# Altium schematic sheet PV_PWM_heater_v2.SchDoc
size A3
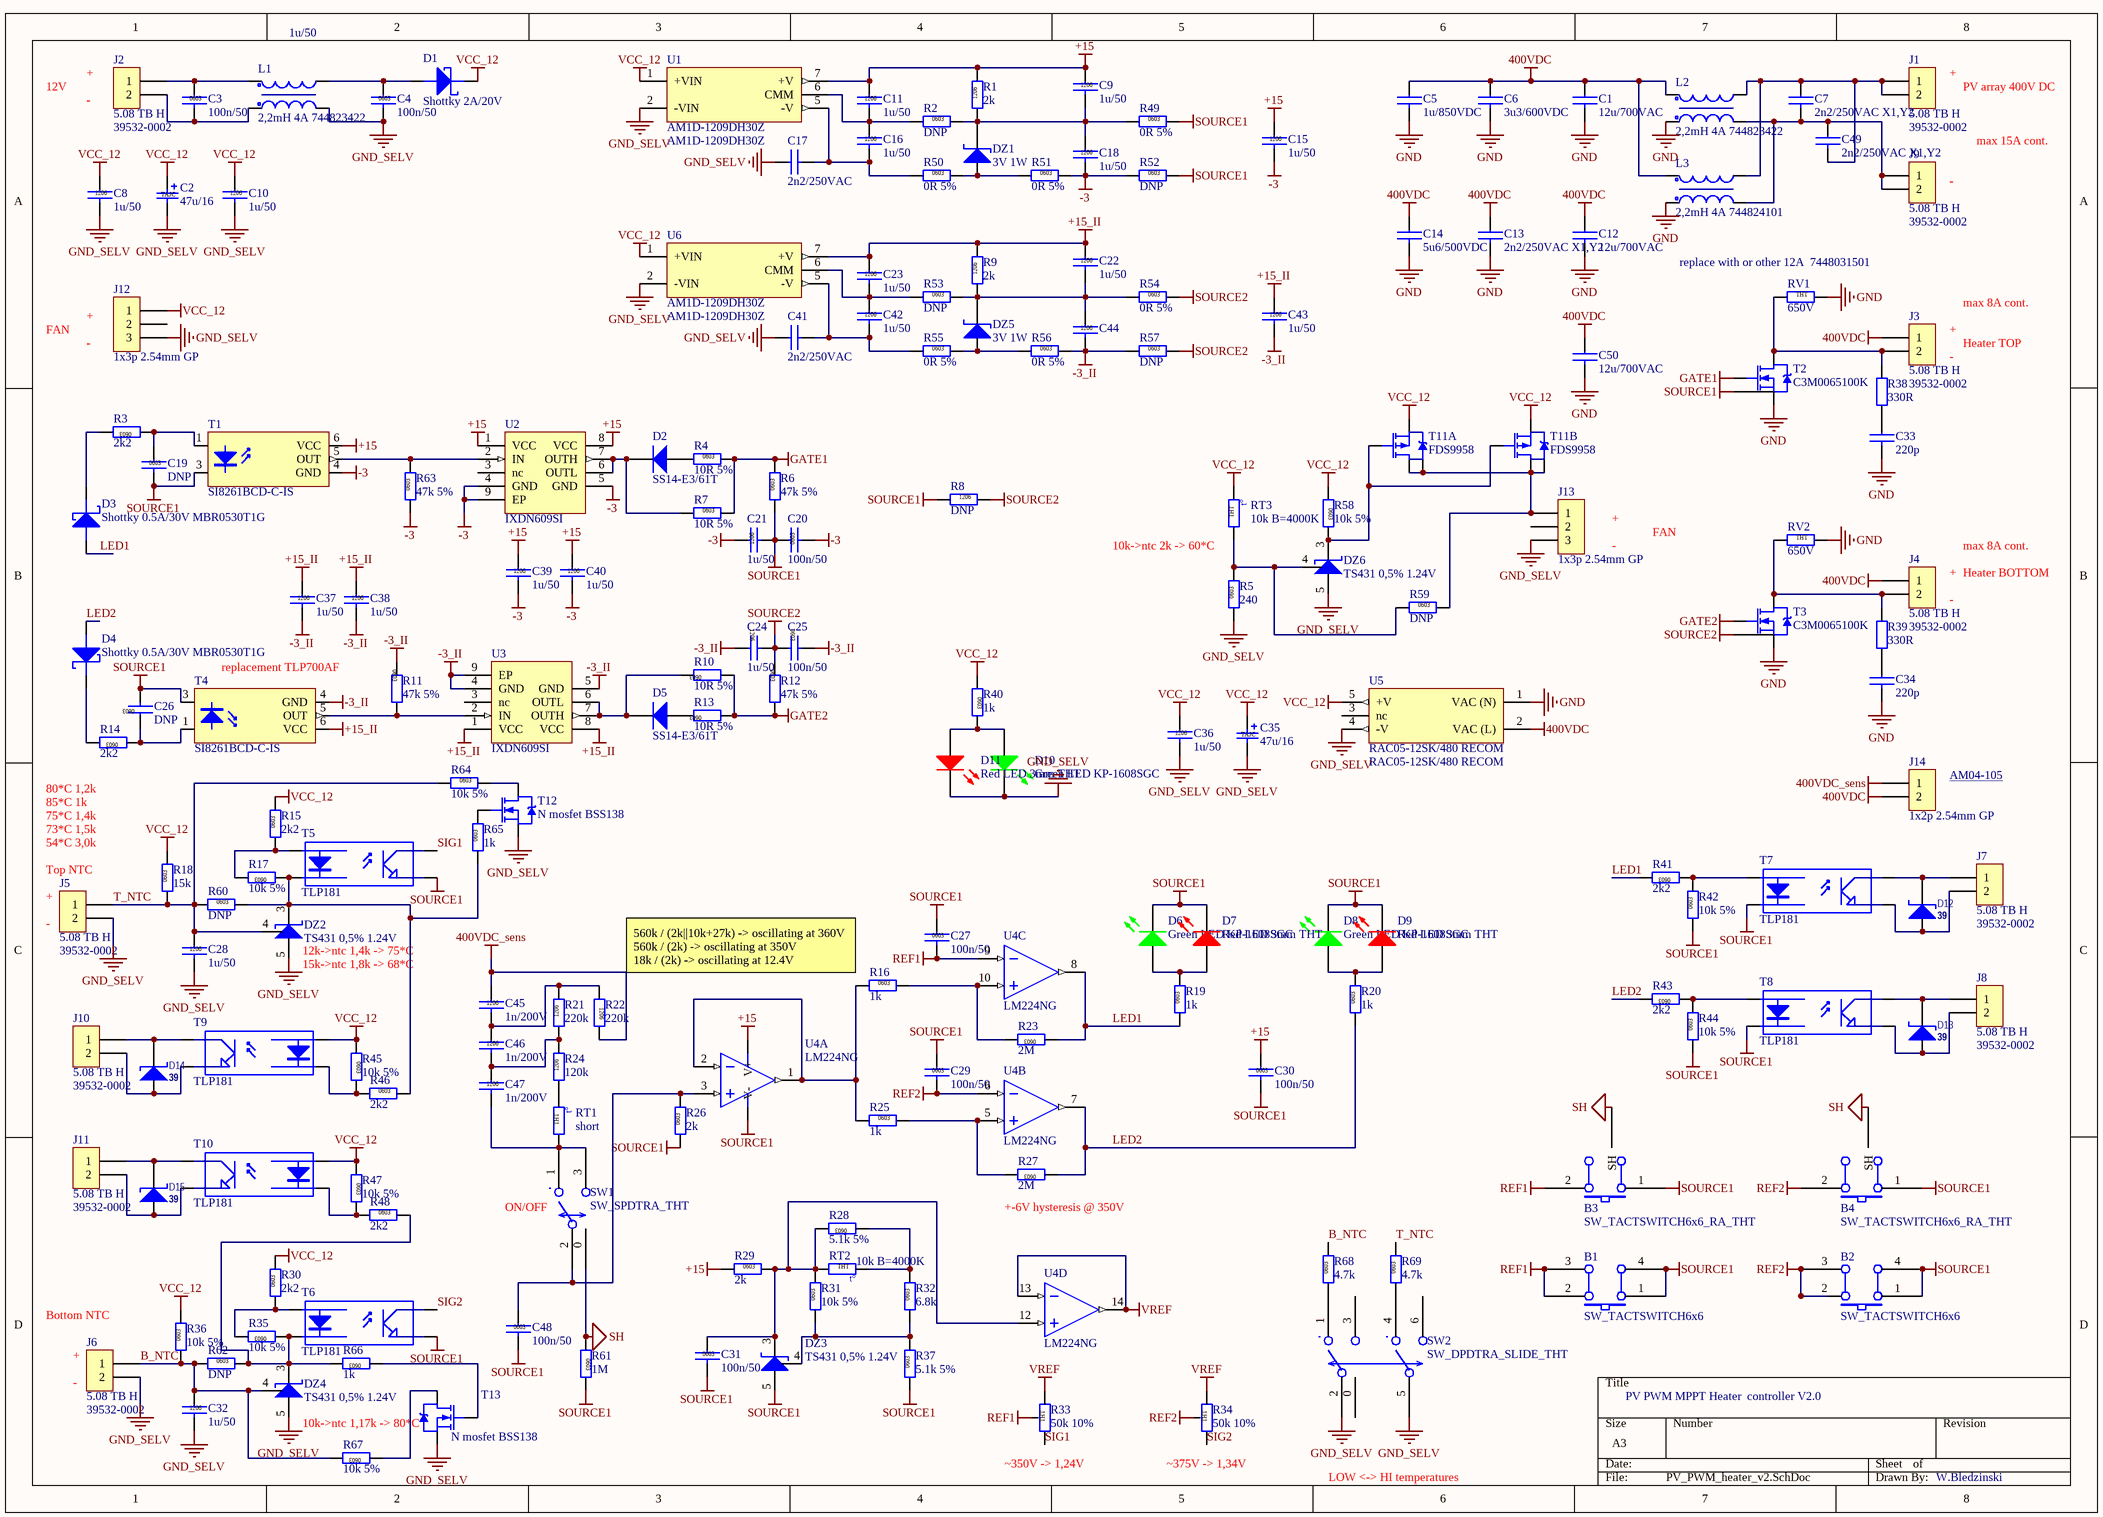
[diagram p0: PV_PWM_heater_v2.SchDoc]

## Parts
B1  SW_TACTSWITCH6x6  [SW_TACT6x6]
B2  SW_TACTSWITCH6x6  [SW_TACT6x6]
B3  SW_TACTSWITCH6x6_RA_THT  [SW_TACT6x6_RA]
B4  SW_TACTSWITCH6x6_RA_THT  [SW_TACT6x6_RA]
C1  12u/700VAC  [CAP_THT27.5mm]
C2  47u/16  [TAJC]
C3  100n/50  [CAP_0603]
C4  100n/50  [CAP_0603]
C5  1u/850VDC  [CAP_AXIAL50X20mm]
C6  3u3/600VDC  [CAP_THT27.5X22mm]
C7  2n2/250VAC X1,Y2  [CAP_THT7.5mm]
C8  1u/50  [CAP_1206]
C9  1u/50  [CAP_1206]
C10  1u/50  [CAP_1206]
C11  1u/50  [CAP_1206]
C12  12u/700VAC  [CAP_THT27.5mm]
C13  2n2/250VAC X1,Y2  [CAP_THT7.5mm]
C14  5u6/500VDC  [CAP_THT27.5X11mm]
C15  1u/50  [CAP_1206]
C16  1u/50  [CAP_1206]
C17  2n2/250VAC  [CAP_THT10mm]
C18  1u/50  [CAP_1206]
C19  DNP  [CAP_0603]
C20  100n/50  [CAP_0603]
C21  1u/50  [CAP_1206]
C22  1u/50  [CAP_1206]
C23  1u/50  [CAP_1206]
C24  1u/50  [CAP_1206]
C25  100n/50  [CAP_0603]
C26  DNP  [CAP_0603]
C27  100n/50  [CAP_0603]
C28  1u/50  [CAP_1206]
C29  100n/50  [CAP_0603]
C30  100n/50  [CAP_0603]
C31  100n/50  [CAP_0603]
C32  1u/50  [CAP_1206]
C33  220p  [CAP_THT7.5mm]
C34  220p  [CAP_THT7.5mm]
C35  47u/16  [TAJC]
C36  1u/50  [CAP_1206]
C37  1u/50  [CAP_1206]
C38  1u/50  [CAP_1206]
C39  1u/50  [CAP_1206]
C40  1u/50  [CAP_1206]
C41  2n2/250VAC  [CAP_THT10mm]
C42  1u/50  [CAP_1206]
C43  1u/50  [CAP_1206]
C44  1u/50  [CAP_1206]
C45  1n/200V  [CAP_1206]
C46  1n/200V  [CAP_1206]
C47  1n/200V  [CAP_1206]
C48  100n/50  [CAP_0603]
C49  2n2/250VAC X1,Y2  [CAP_THT7.5mm]
C50  12u/700VAC  [CAP_THT27.5mm]
D1  Shottky 2A/20V  [SMA_DO-214AC]
D2  SS14-E3/61T  [SMA_DO-214AC]
D3  Shottky 0.5A/30V MBR0530T1G  [SOD_123]
D4  Shottky 0.5A/30V MBR0530T1G  [SOD_123]
D5  SS14-E3/61T  [SMA_DO-214AC]
D6  Green LED KP-1608SGC  [LED_0603_GREEN]
D7  Red LED 3mm THT  [LED_3MM]
D8  Green LED KP-1608SGC  [LED_0603_GREEN]
D9  Red LED 3mm THT  [LED_3MM]
D10  Green LED KP-1608SGC  [LED_0603_GREEN]
D11  Red LED 3mm THT  [LED_3MM]
D12  39  [SMA_DO-214AC]
D13  39  [SMA_DO-214AC]
D14  39  [SMA_DO-214AC]
D15  39  [SMA_DO-214AC]
DZ1  3V 1W  [D_DO-15_DO-204AC]
DZ2  TS431 0,5% 1.24V  [SOT23_5_DBV_R-PDSO-G5]
DZ3  TS431 0,5% 1.24V  [SOT23_5_DBV_R-PDSO-G5]
DZ4  TS431 0,5% 1.24V  [SOT23_5_DBV_R-PDSO-G5]
DZ5  3V 1W  [D_DO-15_DO-204AC]
DZ6  TS431 0,5% 1.24V  [SOT23_5_DBV_R-PDSO-G5]
J1  5.08 TB H  Manufacturer Part Number: 39532-0002  [CON_1x2_5.08TBRA]
J2  5.08 TB H  Manufacturer Part Number: 39532-0002  [CON_1x2_5.08TBRA]
J3  5.08 TB H  Manufacturer Part Number: 39532-0002  [CON_1x2_5.08TBRA]
J4  5.08 TB H  Manufacturer Part Number: 39532-0002  [CON_1x2_5.08TBRA]
J5  5.08 TB H  Manufacturer Part Number: 39532-0002  [CON_1x2_5.08TBRA]
J6  5.08 TB H  Manufacturer Part Number: 39532-0002  [CON_1x2_5.08TBRA]
J7  5.08 TB H  Manufacturer Part Number: 39532-0002  [CON_1x2_5.08TBRA]
J8  5.08 TB H  Manufacturer Part Number: 39532-0002  [CON_1x2_5.08TBRA]
J9  5.08 TB H  Manufacturer Part Number: 39532-0002  [CON_1x2_5.08TBRA]
J10  5.08 TB H  Manufacturer Part Number: 39532-0002  [CON_1x2_5.08TBRA]
J11  5.08 TB H  Manufacturer Part Number: 39532-0002  [CON_1x2_5.08TBRA]
J12  1x3p 2.54mm GP  [CON_PIN1x3_THT]
J13  1x3p 2.54mm GP  [CON_PIN1x3_THT]
J14  1x2p 2.54mm GP  [CON_PIN1x2_THT]
L1  2,2mH 4A 744823422  [IND_WE-CMB-M]
L2  2,2mH 4A 744823422  [IND_WE-CMB-M]
L3  2,2mH 4A 744824101  [IND_WE-CMB-l]
R1  2k  [RES_1206]
R2  DNP  [RES_0603]
R3  2k2  [RES_0603]
R4  10R 5%  [RES_0603]
R5  240  [RES_0603]
R6  47k 5%  [RES_0603]
R7  10R 5%  [RES_0603]
R8  DNP  [RES_1206]
R9  2k  [RES_1206]
R10  10R 5%  [RES_0603]
R11  47k 5%  [RES_0603]
R12  47k 5%  [RES_0603]
R13  10R 5%  [RES_0603]
R14  2k2  [RES_0603]
R15  2k2  [RES_0603]
R16  1k  [RES_0603]
R17  10k 5%  [RES_0603]
R18  15k  [RES_0603]
R19  1k  [RES_0603]
R20  1k  [RES_0603]
R21  220k  [RES_1206]
R22  220k  [RES_1206]
R23  2M  [RES_0603]
R24  120k  [RES_1206]
R25  1k  [RES_0603]
R26  2k  [RES_0603]
R27  2M  [RES_0603]
R28  5.1k 5%  [RES_0603]
R29  2k  [RES_0603]
R30  2k2  [RES_0603]
R31  10k 5%  [RES_0603]
R32  6.8k  [RES_0603]
R33  50k 10%  [RES_PV36]
R34  50k 10%  [RES_PV36]
R35  10k 5%  [RES_0603]
R36  10k 5%  [RES_0603]
R37  5.1k 5%  [RES_0603]
R38  330R  [RES_AXIAL2W]
R39  330R  [RES_AXIAL2W]
R40  1k  [RES_0603]
R41  2k2  [RES_0603]
R42  10k 5%  [RES_0603]
R43  2k2  [RES_0603]
R44  10k 5%  [RES_0603]
R45  10k 5%  [RES_0603]
R46  2k2  [RES_0603]
R47  10k 5%  [RES_0603]
R48  2k2  [RES_0603]
R49  0R 5%  [RES_0603]
R50  0R 5%  [RES_0603]
R51  0R 5%  [RES_0603]
R52  DNP  [RES_0603]
R53  DNP  [RES_0603]
R54  0R 5%  [RES_0603]
R55  0R 5%  [RES_0603]
R56  0R 5%  [RES_0603]
R57  DNP  [RES_0603]
R58  10k 5%  [RES_0603]
R59  DNP  [RES_0603]
R60  DNP  [RES_0603]
R61  1M  [RES_0603]
R62  DNP  [RES_0603]
R63  47k 5%  [RES_0603]
R64  10k 5%  [RES_0603]
R65  1k  [RES_0603]
R66  1k  [RES_0603]
R67  10k 5%  [RES_0603]
R68  4.7k  [RES_0603]
R69  4.7k  [RES_0603]
RT1  short  [CON_PIN1x2_THT]
RT2  10k B=4000K  [CON_PIN1x2_THT]
RT3  10k B=4000K  [CON_PIN1x2_THT]
RV1  650V  [RES_VAR_S14]
RV2  650V  [RES_VAR_S14]
SW1  SW_SPDTRA_THT  [SW_SPDT_RA]
SW2  SW_DPDTRA_SLIDE_THT  [SW_DPDT_SLIDE]
T1  SI8261BCD-C-IS  [SDPI6_SOICW6]
T2  C3M0065100K  [TO247-4]
T3  C3M0065100K  [TO247-4]
T4  SI8261BCD-C-IS  [SDPI6_SOICW6]
T5  TLP181  [TOSH-11-4C1_N]
T6  TLP181  [TOSH-11-4C1_N]
T7  TLP181  [TOSH-11-4C1_N]
T8  TLP181  [TOSH-11-4C1_N]
T9  TLP181  [TOSH-11-4C1_N]
T10  TLP181  [TOSH-11-4C1_N]
T11  Manufacturer Part Number: FDS9958  [SOIC8M]  (parts A,B of 2)
T12  N mosfet BSS138  [SOT23-3]
T13  N mosfet BSS138  [SOT23-3]
U1  AM1D-1209DH30Z  [MOD_AIMTEC_AM1D-Z]
U2  IXDN609SI  [SOIC8M_PP]
U3  IXDN609SI  [SOIC8M_PP]
U4  LM224NG  [DIP14]  (parts A,B,C,D of 4)
U5  RAC05-12SK/480 RECOM  [MOD_RAC10-12SK/277]
U6  AM1D-1209DH30Z  [MOD_AIMTEC_AM1D-Z]

## Nets
400VDC: C1.1 C5.1 C6.1 C12.1 C13.1 C14.1 C50.1 J3.1 J4.1 J14.2 L2.1 L3.1 U5.2(VAC_(L))
400VDC_sens: C45.1 J14.1 R22.2
+15: C9.1 C11.1 C15.1 C30.1 C39.1 C40.1 R1.2 R29.1 T1.6(VCC) U1.7(+V) U2.1(VCC) U2.8(VCC) U4.4(V+)
+15_II: C22.1 C23.1 C37.1 C38.1 C43.1 R9.2 T4.6(VCC) U3.1(VCC) U3.8(VCC) U6.7(+V)
-3: C15.2 C18.2 C20.2 C21.1 C39.2 C40.2 R51.2 R52.1 R63.1 T1.4(GND) U2.4(GND) U2.5(GND) U2.9(EP)
-3_II: C24.1 C25.2 C37.2 C38.2 C43.2 C44.2 R11.1 R56.2 R57.1 T4.4(GND) U3.4(GND) U3.5(GND) U3.9(EP)
GATE1: R4.2 R6.2 R7.2 T2.4(G)
GATE2: R10.2 R12.2 R13.2 T3.4(G)
GND: C1.2 C5.2 C6.2 C12.2 C13.2 C14.2 C33.2 C34.2 C50.2 L2.2 L3.2 RV1.2 RV2.2 T2.2(S) T3.2(S) U5.1(VAC_(N))
GND_SELV: C2.2(-) C4.2 C8.2 C10.2 C17.1 C28.2 C32.2 C35.2(-) C36.2 C41.1 D10.2(K) D11.2(K) DZ2.5(A) DZ4.5(A) DZ6.5(A) J5.2 J6.2 J12.3 J13.3 L1.3 R5.1 SW2.2 SW2.5 T12.2(S) T13.2(S) U1.2(-VIN) U5.4(-V) U6.2(-VIN)
REF1: B1.2(B0) B1.3(B1) B3.2(B0) C27.2 R33.2 U4.9(IN3-)
REF2: B2.2(B0) B2.3(B1) B4.2(B0) C29.2 R34.2 U4.6(IN2-)
SH: B3.0(SH) B4.0(SH) R61.1 SW1.0
SOURCE1: B1.1(A0) B1.4(A1) B2.1(A0) B2.4(A1) B3.1(A0) B4.1(A0) C19.2 C20.1 C21.2 C26.2 C27.1 C29.1 C30.2 C31.2 C48.2 D6.2(K) D7.2(K) D8.2(K) D9.2(K) DZ3.5(A) R6.1 R8.1 R26.1 R37.1 R42.1 R44.1 R49.2 R52.2 R61.2 T1.3(K) T2.3(S) T4.3(K) T5.4(E) T6.4(E) T7.3(K) T8.3(K) U4.11(V-)
SOURCE2: C24.2 C25.1 R8.2 R12.1 R54.2 R57.2 T3.3(S)
VCC_12: C2.1(+) C8.1 C10.1 C35.1(+) C36.1 D1.2(K) J12.1 R15.2 R18.2 R30.2 R36.2 R40.1 R45.1 R47.1 R58.1 RT3.2 T9.1(A) T10.1(A) T11.1(S1) T11.3(S2) U1.1(+VIN) U5.5(+V) U6.1(+VIN)
VREF: R33.3 R34.3 U4.13(IN4-) U4.14(OUT4)
B_NTC: C32.1 DZ4.4(ref) J6.1 R36.1 R62.1 R67.2 R68.2
LED1: D3.1(A) R19.1 R23.1 R41.2 U4.8(OUT3)
LED2: D4.1(A) R20.1 R27.1 R43.2 U4.7(OUT2)
SIG1: R33.1 T5.6(C)
SIG2: R34.1 T6.6(C)
T_NTC: C28.1 DZ2.4(ref) J5.1 R18.1 R60.1 R64.1 R69.2
NetC3_1: C3.1 J2.1 L1.1
NetC3_2: C3.2 J2.2 L1.2
NetC4_1: C4.1 D1.1(A) L1.4
NetC7_1: C7.1 C49.2 J1.1 J1.2 L2.4 L3.4
NetC7_2: C7.2 C49.1 J9.1 J9.2 L2.3 L3.3
NetC9_2: C9.2 C18.1 DZ1.2(K) R1.1 R2.2 R49.1
NetC11_2: C11.2 C16.1 R2.1 U1.6(CMM)
NetC16_2: C16.2 C17.2 R50.1 U1.5(-V)
NetC19_1: C19.1 R3.1 T1.1(A)
NetC22_2: C22.2 C44.1 DZ5.2(K) R9.1 R53.2 R54.1
NetC23_2: C23.2 C42.1 R53.1 U6.6(CMM)
NetC26_1: C26.1 R14.1 T4.1(A)
NetC31_1: C31.1 DZ3.3(K) R28.2 R29.2 R31.2 RT2.1 U4.12(IN4+)
NetC33_1: C33.1 R38.1
NetC34_1: C34.1 R39.1
NetC41_2: C41.2 C42.2 R55.1 U6.5(-V)
NetC45_2: C45.2 C46.1 R21.2 R22.1
NetC46_2: C46.2 C47.1 R21.1 R24.2
NetC47_2: C47.2 RT1.1 SW1.1 SW1.3
NetC48_1: C48.1 R26.2 SW1.2 U4.3(IN1+)
NetD2_1: D2.1(A) R4.1
NetD2_2: D2.2(K) R7.1 U2.6(OUTL) U2.7(OUTH)
NetD3_2: D3.2(K) R3.2
NetD4_2: D4.2(K) R14.2
NetD5_1: D5.1(A) R13.1
NetD5_2: D5.2(K) R10.1 U3.6(OUTL) U3.7(OUTH)
NetD6_1: D6.1(A) D7.1(A) R19.2
NetD8_1: D8.1(A) D9.1(A) R20.2
NetD10_1: D10.1(A) D11.1(A) R40.2
NetD12_1: D12.1(A) J7.2 T7.4(E)
NetD12_2: D12.2(K) J7.1 T7.6(C)
NetD13_1: D13.1(A) J8.2 T8.4(E)
NetD13_2: D13.2(K) J8.1 T8.6(C)
NetD14_1: D14.1(A) J10.2 T9.4(E)
NetD14_2: D14.2(K) J10.1 T9.6(C)
NetD15_1: D15.1(A) J11.2 T10.4(E)
NetD15_2: D15.2(K) J11.1 T10.6(C)
NetDZ1_1: DZ1.1(A) R50.2 R51.1
NetDZ2_3: DZ2.3(K) R17.1 R46.2 R60.2 R65.1 T5.3(K)
NetDZ3_4: DZ3.4(ref) R31.1 R32.1 R37.2
NetDZ4_3: DZ4.3(K) R35.1 R48.2 R62.2 R66.2 T6.3(K)
NetDZ5_1: DZ5.1(A) R55.2 R56.1
NetDZ6_3: DZ6.3(K) R58.2 T11.2(G2) T11.4(G2)
NetDZ6_4: DZ6.4(ref) R5.2 R59.1 RT3.1
NetJ3_2: J3.2 R38.2 RV1.1 T2.1(D)
NetJ4_2: J4.2 R39.2 RV2.1 T3.1(D)
NetJ13_1: J13.1 R59.2 T11.5(D21) T11.6(D22) T11.7(D1) T11.8(D1)
NetR11_2: R11.2 T4.5(OUT) U3.2(IN)
NetR15_1: R15.1 R17.2 T5.1(A)
NetR16_1: R16.1 R25.1 U4.1(OUT1) U4.2(IN1-)
NetR16_2: R16.2 R23.2 U4.10(IN3+)
NetR24_1: R24.1 RT1.2
NetR25_2: R25.2 R27.2 U4.5(IN2+)
NetR28_1: R28.1 R32.2 RT2.2
NetR30_1: R30.1 R35.2 T6.1(A)
NetR41_1: R41.1 R42.2 T7.1(A)
NetR43_1: R43.1 R44.2 T8.1(A)
NetR45_2: R45.2 R46.1 T9.3(K)
NetR47_2: R47.2 R48.1 T10.3(K)
NetR63_2: R63.2 T1.5(OUT) U2.2(IN)
NetR64_2: R64.2 T12.3(D)
NetR65_2: R65.2 T12.1(G)
NetR66_1: R66.1 T13.1(G)
NetR67_1: R67.1 T13.3(D)
NetR68_1: R68.1 SW2.1
NetR69_1: R69.1 SW2.4

Not connected (* = marked no-connect by the designer): J12 2; J13 2; SW2 0 3 6; U2 3(nc); U3 3(nc); U5 3(nc)

## Notes on the sheet
- 12V
- (near J2) +
- (near J2) -
- (near J1) +
- PV array 400V DC
- (near J9) -
- max 15A cont.
- (near J12) +
- (near RV1) replace with or other 12A  7448031501
- max 8A cont.
- FAN
- (near J12) -
- (near J3) +
- (near J3) -
- Heater TOP
- (near J13) +
- (near RT3) 10k->ntc 2k -> 60*C
- (near J13) -
- (near J4) +
- Heater BOTTOM
- (near J4) -
- (near T4) replacement TLP700AF
- (near R14) 80*C 1,2k
- (near J14) AM04-105
- 75*C 1,4k
- 85*C 1k
- 73*C 1,5k
- 54*C 3,0k
- (near J5) Top NTC
- (near J5) +
- (near J5) -
- (near DZ2) 12k->ntc 1,4k -> 75*C
- (near DZ2) 15k->ntc 1,8k -> 68*C
- (near R16) 560k / (2k||10k+27k) -> oscillating at 360V
  560k / (2k) -> oscillating at 350V
  18k / (2k) -> oscillating at 12.4V
- (near SW1) ON/OFF
- (near R27) +-6V hysteresis @ 350V
- (near J6) Bottom NTC
- (near J6) +
- (near J6) -
- PV PWM MPPT Heater
- controller V2.0
- (near T13) 10k->ntc 1,17k -> 80*C
- (near R33) ~350V -> 1,24V
- (near R34) ~375V -> 1,34V
- LOW <-> HI temperatures
- W.Bledzinski
- (in symbol CAP_B_1u_50_1206_X7R) 1206
- (in symbol CAP_B_100n_50_0603_X7R) 0603
- (in symbol CAP_B_100n_50_1206_C0G) 1206
- (in symbol CAP_E_47u_16_TAJC) TAJC
- (in symbol RES_0R_5p_0603) 0603
- (in symbol RES_0R_5p_1206) 1206
- (in symbol RES_3k_5p_0603) 0603
- (in symbol RES_5.1k_5p_0603) 0603
- (in symbol RES_10k_5p_0603) 0603
- (in symbol RES_10R_5p_0603) 0603
- (in symbol RES_47k_5p_0603) 0603
- (in symbol RES_510R_5p_1206) 1206
- (in symbol REST_10k_10p_THT) t°
- (in symbol RESV_50k_10p_THT) THT

## Library data of the parts
B1 B2 = SW_TACTSWITCH6x6: SE PUSHBUTTON; Manufacturer: ITT C&K; Manufacturer Part Number: PTS645SK50SMTR92LFS; Max Current Rating: 50mA; Max Voltage Rating (DC): 12V; Mechanical Life: 100000Cycles; Operating Force: 2.55N; Contact Resistance: 100mR; Actuator Length: 1.55mm; Throw Configuration: SPST; Max Operating Temperature: 60°C; Min Operating Temperature: -20°C; Current Rating: 50mA; Depth: 9mm; Supplier Part Number 1: PTS645SK50SMTR92; Supplier 1: TME; Supplier Unit Price 1: $0.1402
B3 B4 = SW_TACTSWITCH6x6_RA_THT: SE PUSHBUTTON; Manufacturer: TE; Manufacturer Part Number: 1-1825027-1; Max Current Rating: 50mA; Contact Resistance: 100mR; Throw Configuration: SPST; Current Rating: 50mA; Supplier Part Number 1: 1-1825027-1; Supplier 1: TME; Supplier Unit Price 1: $0.1402
C1 C12 C50 = CAP_B_12u_700_THT: poliester capacitor THT; Manufacturer: EPCOS; Manufacturer Part Number: B32774D8126K000; Tolerance: 10%; Voltage: 700VAC; Category: CAP; Price1k: 6; Price10: 8; Supplier: TME; Type: THT; Value: 12u/700VAC; Supplier 1: FARNELL
C2 C35 = CAP_E_47u_16_TAJC: ESR 1.2R 10VDC at 125stC; Manufacturer: KEMET; Manufacturer Part Number: T491C476K016AT; Current: 300mA; Eng.: W.Bledzinski 22.05.2014; Tolerance: 10%; Type: SMD; Voltage: 16; Category: CAP; Price1k: 0.3; Price10: 0.4; Supplier: TME; Supplier Part Number: T491C476K016AT; Temperature: -55 to + 125 stC; Value: 47u/16; Supplier 1: Farnell; Supplier Part Number 1: 1457486
C3 C4 C20 C25 C27 C29-C31 C48 = CAP_B_100n_50_0603_X7R: X7R chip capacitor; Manufacturer: SAMSUNG; Manufacturer Part Number: CL10B104KB8NNNC; Eng.: W.Bledzinski 23.5.2013; Tolerance: 10%; Type: SMD; Voltage: 50; Category: CAP; Price1k: 0.006; Price10: 0.1; Supplier: TME; Supplier Part Number: CL10B104KB8NNNC; Temperature: -55 to + 125 stC; Value: 100n/50
C5 = CAP_B_1u_850_THT: poliester capacitor THT, esr 5mR, 9A/140A pk; Manufacturer: KEMET; Manufacturer Part Number: C4GAMUC4100AA1J; Tolerance: 5%; Voltage: 850VDC; Category: CAP; Price1k: 2.44; Price10: 3.8; Supplier: TME; Supplier Part Number: C4GAMUC4100AA1J; Type: THT; Value: 1u/850VDC; Supplier 1: FARNELL; Supplier Part Number 1: 2808972
C6 = CAP_B_3u3_600_THT: poliester capacitor THT, esr 2.4mR, 25A/342A pk; 350VAC; Manufacturer: KEMET; Manufacturer Part Number: C4ATHBW4330A3GJ; Tolerance: 5%; Voltage: 600VDC; Category: CAP; Price1k: 4.02; Price10: 6.18; Supplier: TME; Supplier Part Number: C4ATHBW4330A3GJ; Type: THT; Value: 3u3/600VDC; Supplier 1: FARNELL; Supplier Part Number 1: 2664828
C7 C13 C49 = CAP_B_2n2_250_X1Y2_THT: poliester capacitor THT X1 Y2, Y5V; Manufacturer Part Number: CY2V-2N2; Eng.: W.Bledzinski 11.02.2014; Tolerance: 20%; Voltage: 250VAC; Category: CAP; Price1k: 0.25; Price10: 0.3; Supplier: TME; Supplier Part Number: CY2V-2N2; Temperature: 0 to +70 stC; Type: THT; Value: 2n2/250VAC X1,Y2
C8-C11 C15 C16 C18 C21-C24 C28 C32 C36-C40 C42-C44 = CAP_B_1u_50_1206_X7R: X7R chip capacitor; Manufacturer: TDK; Manufacturer Part Number: C3216X7R1H105K160AB; Eng.: W.Bledzinski 5.6.2013; Tolerance: 10%; Type: SMD; Voltage: 50; Category: CAP; Price1k: 0.044; Price10: 0.24; Supplier: TME; Supplier Part Number: 12065C105KAT2A; Temperature: -55 to + 125 stC; Value: 1u/50; Supplier 1: FARNELL; Supplier Part Number 1: 1857302
C14 = CAP_B_5u6_500_THT: poliester capacitor THT, esr 13mR,; Manufacturer: KEMET; Manufacturer Part Number: C4AQLBU4560A1WK; Tolerance: 10%; Voltage: 500VDC; Category: CAP; Supplier: TME; Supplier Part Number: C4AQLBU4560A1WK; Type: THT; Value: 5u6/500VDC; Supplier 1: FARNELL; Supplier Part Number 1: 2846425; Price1k: 0.8; Price10: 2
C17 C41 = CAP_B_2n2_250_THT: poliester capacitor THT Y2; Manufacturer: WIMA; Manufacturer Part Number: MPY20W1220FA00MSSD; Eng.: W.Bledzinski 11.02.2014; Tolerance: 20%; Voltage: 250VAC; Category: CAP; Price1k: 0.25; Price10: 0.3; Supplier: TME; Supplier Part Number: MP3-Y2-2N2; Type: THT; Value: 2n2/250VAC
C19 C26 = CAP_B_100n_50_0603_X7R: X7R chip capacitor; Manufacturer: SAMSUNG; Manufacturer Part Number: CL10B104KB8NNNC; Eng.: W.Bledzinski 23.5.2013; Tolerance: 10%; Type: SMD; Value: 100n/50; Voltage: 50; Category: CAP; Price1k: 0.006; Price10: 0.1; Supplier: TME; Supplier Part Number: CL10B104KB8NNNC; Temperature: -55 to + 125 stC
C33 C34 = CAP_B_2n2_250_X1Y2_THT: poliester capacitor THT X1 Y2, Y5V; Manufacturer Part Number: CY2V-2N2; Eng.: W.Bledzinski 11.02.2014; Tolerance: 20%; Value: 2n2/250VAC X1,Y2; Voltage: 250VAC; Category: CAP; Price1k: 0.25; Price10: 0.3; Supplier: TME; Supplier Part Number: CY2V-2N2; Temperature: 0 to +70 stC; Type: THT
C45-C47 = CAP_B_100n_50_1206_C0G: C0G chip capacitor; Manufacturer: TDK; Manufacturer Part Number: CGA5L2C0G1H104J160AA; Eng.: W.Bledzinski 25.04.2014; Tolerance: 5%; Type: SMD; Voltage: 50; Category: CAP; Price1k: 0.16; Price10: 0.7; Supplier: FARNELL; Supplier Part Number: 2211074; Temperature: -55 to + 125 stC; Value: 1n/200V; Supplier 1: FARNELL; Supplier Part Number 1: 2211074
D1 = D_2A_20_B220A: Shottky Diode 0,5V @ 2A SMA 200pF; Manufacturer: DIODES; Manufacturer Part Number: B220A-13-F; Current: 2; Eng.: W.Bledzinski 4.6.2013; Type: SMD; Voltage: 20; Category: DIODE; Price1k: 0.06; Price10: 0.15; Supplier: AVNET; Supplier Part Number: B220-13-F; Temperature: -65 to + 150 stC; Value: Shottky 2A/20V; Supplier 1: FARNELL; Supplier Part Number 1: 1858604
D2 D5 = D_SS14: Manufacturer: Vishay Semiconductors; Type: SMD; Current Rating: 1A; Forward Voltage: 500mV; Max Forward Surge Current (Ifsm): 40A; Max Repetitive Reverse Voltage (Vrrm): 40V; Max Reverse Leakage Current: 200uA; Category: DIODE; Manufacturer Part Number: SS14-E3/61T; Supplier Unit Price 1: $0.26376; Supplier 1: TME; Supplier Part Number 1: SS14-E3/61T
D3 D4 = D_0.5A_30_MBR0530T1G: Shottky Diode trr 4ns 0,43V @ 0.5A 0.37V@0.1A; Manufacturer: ON; Current: 500mA; Eng.: W.Bledzinski 18.11.2013; Type: SMD; Voltage: 30; Category: DIODE; Manufacturer Part Number: MBR0530T1G; Price1k: 0.06; Price10: 0.38; Supplier: TME; Supplier Part Number: MBR0530T1G; Temperature: -65 to +125 stC; Value: Shottky 0.5A/30V MBR0530T1G; Supplier 1: FARNELL; Supplier Part Number 1: 1431036
D6 D8 D10 = D_LED_0603_GREEN: Diode LED SMD 2.2V @ 20mA 15mcd; Manufacturer: KINGBRIGHT; Eng.: W.Bledzinski 22.5.2013; Voltage: 5; Category: LED; Current: 20mA; Manufacturer Part Number: KP-1608SGC; Price1k: 0.03; Price10: 0.05; Supplier: TME; Supplier Part Number: KP-1608SGC; Temperature: -40 to +85 stC; Type: SMD; Value: Green LED KP-1608SGC; Supplier 1: Farnell; Supplier Part Number 1: 8529833
D7 D9 D11 = D_LED3_THT_RED: Diode LED THT; Manufacturer: KINGBRIGHT; Manufacturer Part Number: L-934SRC-E; Current: 20mA; Eng.: W.Bledzinski 05.06.2014; Type: SMD; Voltage: 5; Category: LED; Price1k: 0.1; Price10: 0.12; Supplier: TME; Supplier Part Number: L-934SRC/E; Temperature: -40 to +85 stC; Value: Red LED 3mm THT; Supplier 1: Farnell; Supplier Part Number 1: 1142524
D12-D15 = D_TR_UNI_SMA6TY_39V: transil jednostronny; Manufacturer: STM; Manufacturer Part Number: SMA6T39AY; Current: 57A; Eng.: W.Bledzinski 22.5.2013; Type: SMD; Value: Transil_U_600W; Category: DIODE; Price1k: 0.4; Price10: 1; Supplier: ARROW; Supplier Part Number: SMA6T39AY; Temperature: -40 to + 150 stC; Voltage: 39; Supplier 1: Digi-key; Supplier Part Number 1: 497-10949-2-ND
DZ1 DZ5 = D_1W_20_ZENER: Eng.: W.Bledzinski 23.06.2015; Voltage: 3; Category: DIODE; Price1k: 0.04; Price10: 0.08; Supplier: TME; Supplier Part Number: 1.3W-3V; Temperature: -65 to + 150 stC; Type: THT; Value: 3V 1W; Supplier 1: TME; Supplier Part Number 1: 1.3W-3V
DZ2-DZ4 DZ6 = D_TS431BILT: 0,5% 1.24V vref; Manufacturer: STMicroelectronics; Current: 40mA; Voltage: 10V; Category: DIODE; Supplier: TME; Type: SMD; Value: TS431 0,5% 1.24V; Pricing: 6000=0.2339, 12000=0.2229, 18000=0.2129, 30000=0.2029, 60000=0.1989 (USD); Manufacturer Part Number: TS431BILT; Supplier 1: Avnet; Supplier Part Number 1: TS431BILT
J1-J11 = CON_1x2_TB_5.08H: THT 5,08mm, WE 691312510002, NINIGI TBG-5-KB-2P/GN, MLX 395320002; Manufacturer: Molex; Pitch: 0.200" (5.08mm); Current: 20A; Supplier Unit Price 1: $0.8421; Supplier 2: TME; Supplier 1: Mouser; Supplier Part Number 1: 710-691312510002; Supplier Part Number 2: TBG-5-KB-2P/GN
J12 J13 = CON_1x3_GP_THT: THT 2,54 goldpin; Manufacturer: TME; Manufacturer Part Number: ZL201-03G; Manufacturer2 Part Number: MX-90120-0123; Current: 3A; Eng.: W.Bledzinski 14.11.2013; Category: CONN; Price1k: 0.1; Price10: 0.15; Supplier: TME; Supplier Part Number: ZL201-03G; Temperature: -55 to +125 stC; Type: THT; Value: 1x3p 2.54mm GP; Manufacturer2: MOLEX; Supplier 1: digi-key; Supplier Part Number 1: WM8073-ND
J14 = CON_1x2_GP_THT: THT 2,54 goldpin; Manufacturer: TME; Manufacturer Part Number: ZL201-02G; Manufacturer2 Part Number: MX-90120-0122; Current: 3A; Eng.: W.Bledzinski 29.5.2013; Category: CONN; Price1k: 0.1; Price10: 0.15; Supplier: TME; Supplier Part Number: ZL201-02G; Temperature: -55 to +125 stC; Type: THT; Value: 1x2p 2.54mm GP; Manufacturer2: MOLEX; Supplier 1: digi-key; Supplier Part Number 1: WM8072-ND
L1 L2 = IND_WE-CMB_2.2mH_4A_THT: 2x2,2mH 40dB 1MHz 4A 250VAC Rdc=2x0,03 SRF1MHz; Manufacturer: WE; Eng.: W.Bledzinski 23.03.2015; Tolerance: 30%; Type: THT; Category: IND; Current: 4A; Manufacturer Part Number: 744823422; Price1k: 4.5; Price10: 5; Supplier: RS-Components; Supplier Part Number: 489-0273; Temperature: -40 to + 125 stC; Value: 2,2mH 4A 744823422; Supplier 1: Digi-Key; Supplier Part Number 1: 732-1445-ND
L3 = IND_WE-CMB_2.2mH_10A_THT: 2x2,2mH 30dB 1MHz 10A 250VAC Rdc=2x0,007 SRF1MHz; Manufacturer: WE; Tolerance: 30%; Type: THT; Category: IND; Current: 10A; Manufacturer Part Number: 744824101; Price1k: 4.5; Price10: 5; Supplier: RS-Components; Temperature: -40 to + 125 stC; Value: 2,2mH 4A 744824101; Supplier 1: Digi-Key; Supplier Part Number 1: 732-1449-ND
R1 R9 R21 R22 R24 = RES_510R_5p_1206: Resistor 1206 5% 0,25W; Manufacturer: YAGEO; Manufacturer Part Number: RC1206JR-07510R; Eng.: W.Bledzinski 14.05.2014; Value: 510R 5%; Voltage: 500; Category: RES; Price1k: 0.004; Price10: 0.009; Supplier: TME; Supplier Part Number: RC1206JR-07510R; Temperature: -55 to + 125 stC; Tolerance: 5%; Type: SMD; Supplier 1: Farnell; Supplier Part Number 1: 2057829
R2 R52 R53 R57 = RES_0R_5p_0603: 0603 ,1W; Manufacturer: YAGEO; Manufacturer Part Number: RC0603JR-070RL; Eng.: W.Bledzinski 20.01.2014; Tolerance: 5%; Value: 0R 5%; Category: RES; Price1k: 0.003; Price10: 0.09; Supplier: TME; Supplier Part Number: RC0603JR-070R; Temperature: -55 to + 155 stC; Type: SMD; Supplier 1: TME; Supplier Part Number 1: RC0603JR-070R
R3 R14 = RES_3k_5p_0603: Resistor 0603 5% 0,1W; Manufacturer: YAGEO; Eng.: W.Bledzinski 12.06.2015; Voltage: 50; Category: RES; Price1k: 0.003; Price10: 0.01; Supplier: TME; Supplier Part Number: SMD0603-3K; Temperature: -55 to + 125 stC; Tolerance: 5%; Type: SMD; Value: 2k2; Supplier 1: TME; Supplier Part Number 1: SMD0603-3K
R4 R7 R10 R13 = RES_10R_5p_0603: Resistor 0603 5% 0,1W; Manufacturer: YAGEO; Eng.: W.Bledzinski 12.06.2015; Voltage: 50; Category: RES; Price1k: 0.003; Price10: 0.01; Supplier: TME; Supplier Part Number: SMD0603-10R; Temperature: -55 to + 125 stC; Tolerance: 5%; Type: SMD; Value: 10R 5%; Supplier 1: TME; Supplier Part Number 1: SMD0603-10R
R5 = RES_10R_5p_0603: Resistor 0603 5% 0,1W; Manufacturer: YAGEO; Eng.: W.Bledzinski 12.06.2015; Value: 10R 5%; Voltage: 50; Category: RES; Price1k: 0.003; Price10: 0.01; Supplier: TME; Supplier Part Number: SMD0603-10R; Temperature: -55 to + 125 stC; Tolerance: 5%; Type: SMD; Supplier 1: TME; Supplier Part Number 1: SMD0603-10R
R6 R11 R12 R63 = RES_47k_5p_0603: Resistor 0603 5% 0,1W; Manufacturer: YAGEO; Eng.: W.Bledzinski 12.06.2015; Voltage: 50; Category: RES; Price1k: 0.003; Price10: 0.01; Supplier: TME; Supplier Part Number: SMD0603-47K; Temperature: -55 to + 125 stC; Tolerance: 5%; Type: SMD; Value: 47k 5%; Supplier 1: TME; Supplier Part Number 1: SMD0603-47K
R8 = RES_0R_5p_1206: Resistor 1206 5% 0,25W; Manufacturer: ROYAL OHM; Manufacturer Part Number: 1206S4J0000T5E; Eng.: W.Bledzinski 03.06.2014; Value: 0R 5%; Voltage: 200; Current: 2A/4A; Category: RES; Price1k: 0.24; Price10: 0.3; Supplier: TME; Supplier Part Number: SMD1206-0R; Temperature: -55 to + 125 stC; Tolerance: 5%; Type: SMD; Supplier 1: Farnell; Supplier Part Number 1: 9336974
R15 R16 R19 R20 R23 R25-R27 R29 R30 R40 R41 R43 R46 R48 R59-R62 R65 R66 = RES_3k_5p_0603: Resistor 0603 5% 0,1W; Manufacturer: YAGEO; Eng.: W.Bledzinski 12.06.2015; Value: 3k 5%; Voltage: 50; Category: RES; Price1k: 0.003; Price10: 0.01; Supplier: TME; Supplier Part Number: SMD0603-3K; Temperature: -55 to + 125 stC; Tolerance: 5%; Type: SMD; Supplier 1: TME; Supplier Part Number 1: SMD0603-3K
R17 R31 R35 R36 R42 R44 R45 R47 R58 R64 R67-R69 = RES_10k_5p_0603: Resistor 0603 5% 0,1W; Voltage: 50; Category: RES; Price1k: 0.003; Price10: 0.01; Tolerance: 5%; Type: SMD
  R17 R31 R35 R36 R42 R44 R45 R47 R58 R64 R67: Value: 10k 5%
  R68 R69: Value: 4.7k
R18 R32 = RES_10k_5p_0603: Resistor 0603 5% 0,1W; Value: 10k 5%; Voltage: 50; Category: RES; Price1k: 0.003; Price10: 0.01; Tolerance: 5%; Type: SMD
R28 R37 = RES_5.1k_5p_0603: Resistor 0603 5% 0,1W; Voltage: 50; Category: RES; Price1k: 0.003; Price10: 0.01; Supplier: TME; Temperature: -55 to + 125 stC; Tolerance: 5%; Type: SMD; Value: 5.1k 5%; Supplier 1: TME
R33 R34 = RESV_50k_10p_THT: Pot 500mW wieloobrotowy; Manufacturer: SR PASSIVES; Manufacturer Part Number: T910W-50K; Eng.: W.Bledzinski 24.6.2015; Category: RES; Price1k: 0.2; Price10: 0.3; Supplier: TME; Supplier Part Number: T910W-50K; Temperature: -55 to + 125 stC; Tolerance: 10%; Type: SMD; Value: 50k 10%; Supplier 1: TME; Supplier Part Number 1: T910W-50K
R38 R39 = RES_330R_5p_2W: Resistor 2W 5% THT; Category: RES; Tolerance: 5%; Type: THT; Value: 330R
R49-R51 R54-R56 = RES_0R_5p_0603: 0603 ,1W; Manufacturer: YAGEO; Manufacturer Part Number: RC0603JR-070RL; Eng.: W.Bledzinski 20.01.2014; Category: RES; Price1k: 0.003; Price10: 0.09; Supplier: TME; Supplier Part Number: RC0603JR-070R; Temperature: -55 to + 155 stC; Tolerance: 5%; Type: SMD; Value: 0R 5%; Supplier 1: TME; Supplier Part Number 1: RC0603JR-070R
RT1 = REST_10k_10p_THT: TERMISTOR, NTC, 4000K fi 6,5mm; Manufacturer: SR PASSIVES; Manufacturer Part Number: NTCC-10K; Eng.: W.Bledzinski 03.09.2013; Tolerance: 10%; Value: 10k B=4000K; Category: RES; Price1k: 0.1; Price10: 0.3; Supplier: TME; Supplier Part Number: NTCC-10K; Temperature: -55 to + 125 stC; Type: THT; Supplier 1: TME; Supplier Part Number 1: NTCC-10K
RT2 RT3 = REST_10k_10p_THT: TERMISTOR, NTC, 4000K fi 6,5mm; Manufacturer: SR PASSIVES; Manufacturer Part Number: NTCC-10K; Eng.: W.Bledzinski 03.09.2013; Tolerance: 10%; Category: RES; Price1k: 0.1; Price10: 0.3; Supplier: TME; Supplier Part Number: NTCC-10K; Temperature: -55 to + 125 stC; Type: THT; Value: 10k B=4000K; Supplier 1: TME; Supplier Part Number 1: NTCC-10K
RV1 RV2 = RESV_38V_1kA_THT: warystor S14 30VAC 38VDC 1kA 9J@2ms; Manufacturer: EPCOS; Manufacturer Part Number: B72214S0300K101; Eng.: W.Bledzinski 18.05.2015; Tolerance: 10%; Value: B72214S0300K101 30VAC 1kA; Category: VAR; Price1k: 0.38; Price10: 0.83; Supplier: TME; Supplier Part Number: SIOV-S14K30; Temperature: -55 to + 125 stC; Type: THT; Supplier 1: TME; Supplier Part Number 1: SIOV-S14K30
SW1 = SW_SPDTRA_THT: Max Voltage Rating (DC): 12V; Current Rating: 2A; Actuator Length: 1.55mm; Throw Configuration: SPDT; Supplier Part Number 1: https://pl.aliexpress.com/item/4000525611467.html?spm=a2g0s.9042311.0.0.7b675c0frz8uLg; Supplier 1: aliexpress; Supplier Unit Price 1: $0.1402
SW2 = SW_DPDTRA_SLIDE_THT: Manufacturer Part Number: SK22d02; Max Voltage Rating (DC): 12V; Current Rating: 2A; Actuator Length: 1.55mm; Throw Configuration: DPDT; Supplier Part Number 1: https://pl.aliexpress.com/item/32872245827.html?spm=a2g17.12010612.8148356.9.48da3152dKCiYy; Supplier 1: aliexpress; Supplier Unit Price 1: $0.1402; Supplier 2: *; Supplier Part Number 2: EG2208A
T1 T4 = T_SI8261: 4.0 A ISOLATED GATE DRIVER 5kV Vdd6.5-30V; Manufacturer: SiLabs; Type: SMD; Max Input Current: 30mA; Input Current: 6-30mA; Forward Voltage: 1.6-2.8V; Category: TRANSOPTOR; Max Operating Temperature: 125°C; Isolation Voltage: 5kV; Supplier 1: TME; Supplier 2: TME; Supplier Part Number 1: SI8261BCD-C-IS; Supplier Part Number 2: SI8261BCD-C-IS; Manufacturer Part Number: SI8261BCD-C-IS
T2 T3 = T_C3M0065100K_THT: SiC 1kV 35A N mosfet Rdson 0.07@UGS=15V Qg=35nC; Manufacturer: CREE/wolfspeed; Type: THT; Category: TRANSISTOR; Current: 35A; Manufacturer Part Number: C3M0065100K; Price1k: 13; Price10: 16.5; Supplier: TME; Supplier Part Number: C3M0065100K; Temperature: -55 to + 150 stC; Value: C3M0065100K; Voltage: 1kV; Supplier 1: Farnell; Supplier Part Number 1: 2672013
T5-T10 = T_TLP181: transoptor CTR Blank 50 600 Blank ,Y■,YE,G,G■,GR,B,BL,GB / Rank Y 50 150 YE, Y■ / Rank GR 100 300 GR, G, G■ / Rank BL 200 600 BL, B / Rank GB 100 600 GB , GR , G, G■, BL , B / Rank YH 75 150 Y■ / Rank GRL 100 200 G / Rank GRH 150 300 G■ / Rank BLL 200 400 B If 50mA Ic50mA ICE0 0,1uA@10V; Type: SMD
T11 = T_FDS9958: -60V -2.9A 2x P MOSFET, 135/105mR; Manufacturer: ON Semiconductor / Fairchild; Rds On Max: 105mR; Rise Time: 3ns; Threshold Voltage: -1.6V; Turn-Off Delay Time: 27ns; Turn-On Delay Time: 6ns; Power Dissipation: 2W; Input Capacitance: 1.02nF; Gate to Source Voltage (Vgs): 20V; Drain to Source Voltage (Vdss): 60V; Continuous Drain Current (ID): 2.9A; Category: TRANSISTOR; Supplier: FARNELL; Supplier Part Number: 1471052RL; Supplier Unit Price 1: $0.95; Min Operating Temperature: -55°C; Fall Time: 6ns; Drain to Source Breakdown Voltage: -60V; Supplier Part Number 1: FDS9958CT-ND; Supplier Part Number 2: FDS9958; Supplier 2: TME; Supplier 1: Digi-Key
T12 T13 = T_BSS138: 50V 0.3A N mosfet Rdson 6ohm @UGS=4.5V Qg=2.5nC; Manufacturer: FAIRCHILD; Eng.: W.Bledzinski 25.04.2014; Type: SMD; Category: TRANSISTOR; Current: 0.3A; Manufacturer Part Number: BSS138; Price1k: 0.04; Price10: 0.22; Supplier: TME; Supplier Part Number: BSS138; Temperature: -55 to + 150 stC; Value: N mosfet BSS138; Voltage: 50V; Supplier 1: Farnell; Supplier Part Number 1: 2323154
U1 U6 = MOD_AM1D-1209DH30Z_THT: SMPS converter +9V and -9V, 1W, 3kV iso; Manufacturer: AIMTEC; Current: 2W; Voltage: 9, -9V; Category: MODULE; Price1k: 5; Price10: 6; Supplier 1: TME; Supplier: TME; Supplier Part Number 1: AM1D-1209DH30Z; Supplier Part Number: AM1D-1209DH30Z; Temperature: -40 to +85 stC; Type: THT; Value: AM1D-1209DH30Z; Manufacturer Part Number: AM1D-1209DH30Z
U2 U3 = IC_IXDN609SI: single 9A High-speed low side gate driver; Manufacturer: IXYS; Operating voltage: 4.5...35V; Category: IC; Type: THT; Supplier 1: TME; Pricing: 1=1.81, 10=1.3 (USD); Manufacturer Part Number: IXDN609SI; Supplier 2: TME; Supplier Part Number 1: IXDN609SI; Supplier Part Number 2: IXDN609SI
U4 = IC_LM224: LM224_324_2902_NCV2902-14; Manufacturer: ON SEMICONDUCTOR; Operating voltage: 3...32V; Slew rate: 0.6V/μs; Bandwidth: 1MHz; Pricing: 5=0.3313, 25=0.2966, 100=0.2409, 250=0.2051, 1000=0.1832 (USD); Supplier 1: TME; Manufacturer Part Number: LM224NG; Supplier Part Number 1: LM224NG
U5 = MOD_RAC10-12SK/277_THT: SMPS 10W 12V 800mA, 430V DC in; Voltage: 430V to 12V DC; Category: MODULE; Current: 800mA; Manufacturer: RECOM; Price1k: 8; Price10: 10; Supplier 1: TME; Supplier: TME; Supplier Part Number 1: RAC05-12SK/480 RECOM; Supplier Part Number: RAC05-12SK/480 RECOM; Temperature: -40 to +85 stC; Type: THT; Value: RAC05-12SK/480 RECOM; Manufacturer Part Number: RAC05-12SK/480 RECOM